# Altium project onion_dock_altium.PrjPcb
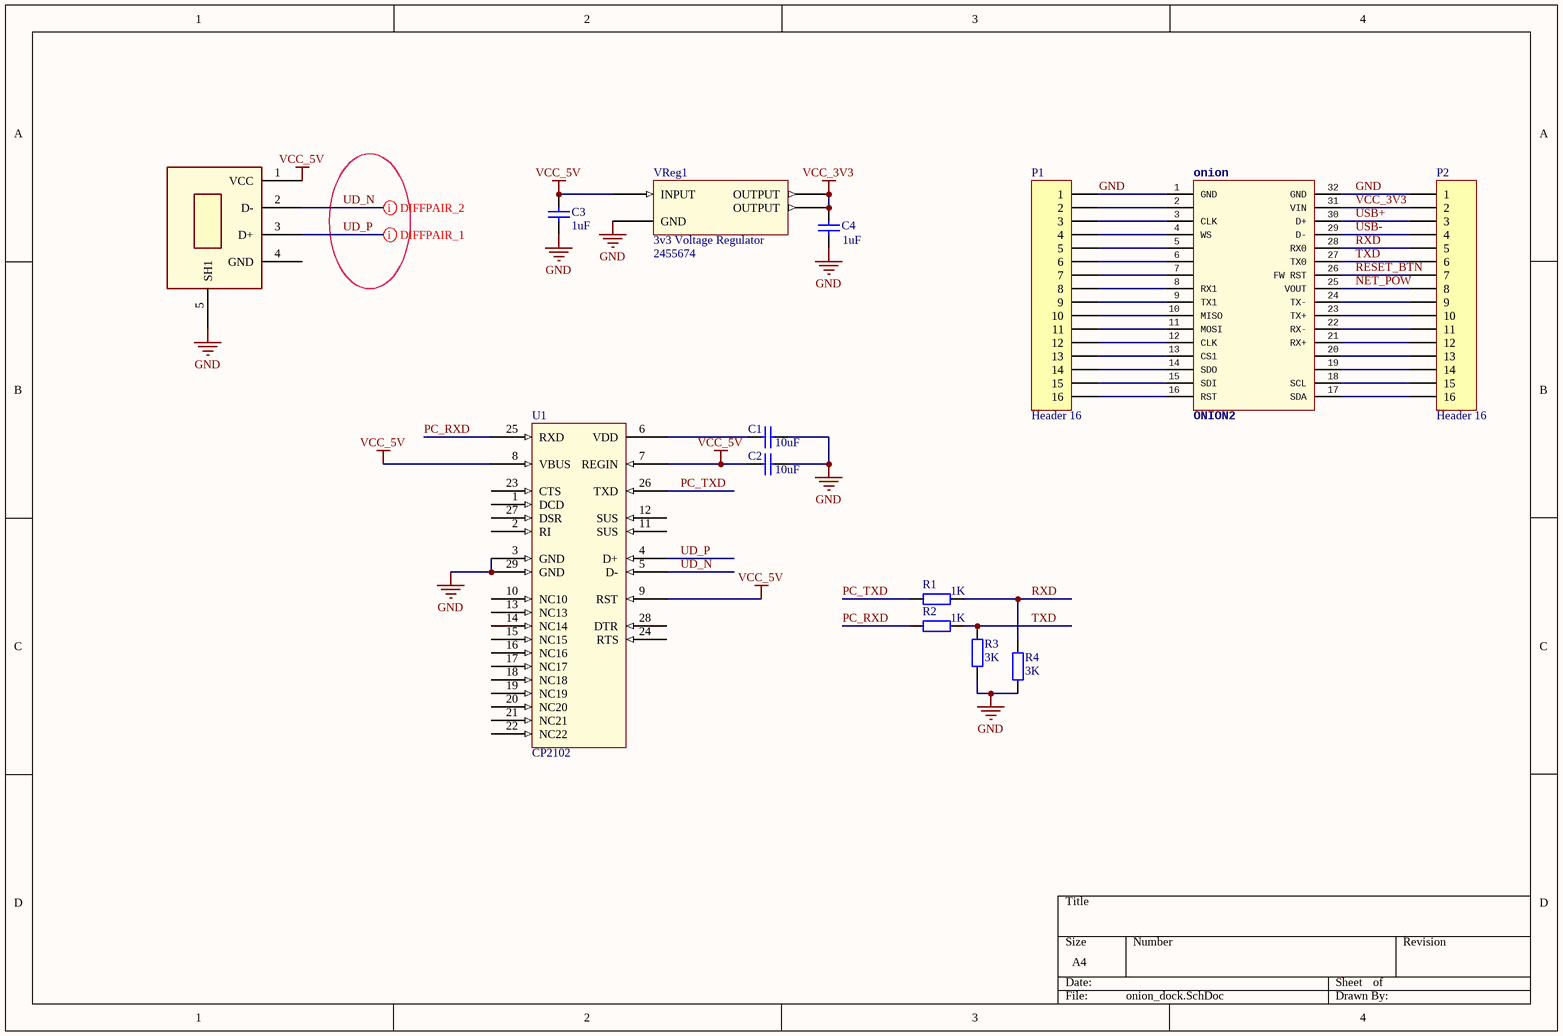
[diagram p0: onion_dock.SchDoc]
1 sheet, 14 parts. Net scope: global (net labels, ports and power ports of the same name join across sheets).
Board file: onion_dock.PcbDoc

## Sheet onion_dock.SchDoc
size A4

### Parts
C1  value 10uF  [C0805]  (hidden comment: C0805_10uF_25V)
C2  value 10uF  [C0805]  (hidden comment: C0805_10uF_25V)
C3  value 1uF  [C0805]  (hidden comment: C0805_1uF_25V)
C4  value 1uF  [C0805]  (hidden comment: C0805_1uF_25V)
onion  ONION2  [ONION2]
P1  Header 16  [HDR1X16]
P2  Header 16  [HDR1X16]
R1  value 1K  [R0805]  (hidden comment: R0805_1K_100mW)
R2  value 1K  [R0805]  (hidden comment: R0805_1K_100mW)
R3  value 3K  [R0805]  (hidden comment: R0805_1K_100mW)
R4  value 3K  [R0805]  (hidden comment: R0805_1K_100mW)
U1  CP2102  [QFN50P500X500X100_HS-29N]
USB  USB  [MicroUSB]  (value not drawn)
VReg1  3v3 Voltage Regulator  Supplier Part Number 1: 2455674  [SOT230P700X180-4N]

### Nets
GND: C1.2 C2.2 C3.1 C4.1 onion.1(GND) onion.32(GND) P1.1 P2.1 R3.1 R4.1 U1.3(GND) U1.29(GND) USB.5(SH1) VReg1.1(GND)
VCC_3V3: C4.2 onion.31(VIN) P2.2 VReg1.2(OUTPUT) VReg1.4(OUTPUT)
VCC_5V: C2.1 C3.2 U1.7(REGIN) U1.8(VBUS) U1.9(RST) USB.1(VCC) VReg1.3(INPUT)
NET_POW: onion.25(VOUT) P2.8
PC_RXD: R2.1 U1.25(RXD)
PC_TXD: R1.1 U1.26(TXD)
RESET_BTN: onion.26(FW_RST) P2.7
RXD: onion.28(RX0) P2.5 R1.2 R4.2
TXD: onion.27(TX0) P2.6 R2.2 R3.2
UD_N: U1.5(D-) USB.2(D-)
UD_P: U1.4(D+) USB.3(D+)
USB+: onion.30(D+) P2.3
USB-: onion.29(D-) P2.4
NetC1_1: C1.1 U1.6(VDD)
Netonion_2: onion.2 P1.2
Netonion_3: onion.3(CLK) P1.3
Netonion_4: onion.4(WS) P1.4
Netonion_5: onion.5 P1.5
Netonion_6: onion.6 P1.6
Netonion_7: onion.7 P1.7
Netonion_8: onion.8(RX1) P1.8
Netonion_9: onion.9(TX1) P1.9
Netonion_10: onion.10(MISO) P1.10
Netonion_11: onion.11(MOSI) P1.11
Netonion_12: onion.12(CLK) P1.12
Netonion_13: onion.13(CS1) P1.13
Netonion_14: onion.14(SDO) P1.14
Netonion_15: onion.15(SDI) P1.15
Netonion_16: onion.16(RST) P1.16
Netonion_17: onion.17(SDA) P2.16
Netonion_18: onion.18(SCL) P2.15
Netonion_19: onion.19 P2.14
Netonion_20: onion.20 P2.13
Netonion_21: onion.21(RX+) P2.12
Netonion_22: onion.22(RX-) P2.11
Netonion_23: onion.23(TX+) P2.10
Netonion_24: onion.24(TX-) P2.9

Not connected (* = marked no-connect by the designer): U1 1(DCD) 2(RI) 10(NC10) 11(SUS) 12(SUS) 13(NC13) 14(NC14) 15(NC15) 16(NC16) 17(NC17) 18(NC18) 19(NC19) 20(NC20) 21(NC21) 22(NC22) 23(CTS) 24(RTS) 27(DSR) 28(DTR); USB 4(GND)

### Layout directives
differential pair: UD_N, UD_P

### Library data of the parts
C1 C2 = C0805_10uF_25V: SMD Multilayer Ceramic Capacitor, 10 µF, ± 10%, X5R, 25 V, 0805 [2012 Metric]; Supplier 1: Farnell; Supplier Part Number 1: 2491176
C3 C4 = C0805_1uF_25V: SMD Multilayer Ceramic Capacitor, 1 µF, ± 10%, X7R, 25 V, 0805 [2012 Metric]; Supplier 1: Farnell; Supplier Part Number 1: 2332737
P1 P2 = Header 16: Header, 16-Pin; LatestRevisionDate: 17-Jul-2002; LatestRevisionNote: Re-released for DXP Platform.; Publisher: Altium Limited
R1 R2 = R0805_1K_100mW: RES, THICK FILM, 1K, 1%,100mW, 0805; Power: 0.1W; Supplier 1: Farnell; Supplier Part Number 1: 9332383
R3 R4 = R0805_1K_100mW: RES, THICK FILM, 1K, 1%,100mW, 0805
VReg1 = 1117LV33: Supplier 1: Farnell
U1 = CP2102: Supplier 1: Mouser; Supplier Part Number 1: 727-CY7C6563428LTXCT
USB = USB: Mouser: http://www.mouser.de/ProductDetail/TE-Connectivity-AMP/292303-1/?qs=sGAEpiMZZMulM8LPOQ%252byk2ChD%2fcRWFzQGYjPa0hd1DM%3d